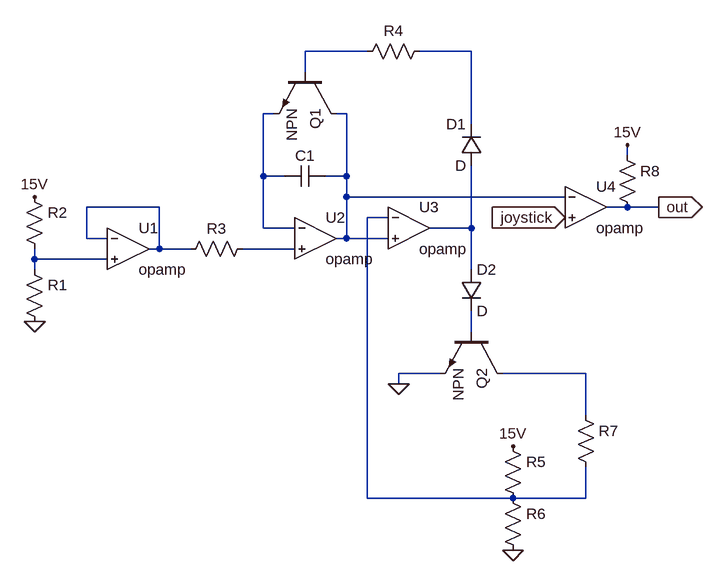
[diagram p0: schematic analogCircuit.asc]
analogCircuit.asc, the LTspice schematic file:
Version 4
SHEET 1 1264 692
WIRE 640 -144 544 -144
WIRE 800 -144 720 -144
WIRE 544 -112 544 -144
WIRE 496 -48 480 -48
WIRE 608 -48 592 -48
WIRE 800 -32 800 -144
WIRE 1040 16 1040 0
WIRE 480 48 480 -48
WIRE 512 48 480 48
WIRE 608 48 608 -48
WIRE 608 48 576 48
WIRE 608 80 608 48
WIRE 944 80 608 80
WIRE 320 96 208 96
WIRE 1040 96 1008 96
WIRE 1088 96 1040 96
WIRE 672 112 640 112
WIRE 480 128 480 48
WIRE 528 128 480 128
WIRE 800 128 800 32
WIRE 800 128 736 128
WIRE 208 144 208 96
WIRE 240 144 208 144
WIRE 608 144 608 80
WIRE 608 144 592 144
WIRE 672 144 608 144
WIRE 320 160 320 96
WIRE 320 160 304 160
WIRE 368 160 320 160
WIRE 528 160 448 160
WIRE 128 176 128 160
WIRE 240 176 128 176
WIRE 128 192 128 176
WIRE 800 192 800 128
WIRE 800 288 800 256
WIRE 752 352 688 352
WIRE 976 352 848 352
WIRE 688 368 688 352
WIRE 976 416 976 352
WIRE 640 544 640 112
WIRE 864 544 640 544
WIRE 976 544 976 496
WIRE 976 544 864 544
FLAG 128 272 0
FLAG 128 80 15V
FLAG 688 368 0
FLAG 864 624 0
FLAG 864 464 15V
FLAG 944 112 joystick
IOPIN 944 112 In
FLAG 1040 0 15V
FLAG 1088 96 out
IOPIN 1088 96 Out
SYMBOL res 112 176 R0
SYMATTR InstName R1
SYMATTR Value ""
SYMBOL Opamps\\opamp 560 80 R0
SYMATTR InstName U2
SYMBOL npn 592 -112 R90
SYMATTR InstName Q1
SYMBOL res 112 64 R0
SYMATTR InstName R2
SYMATTR Value ""
SYMBOL cap 576 32 R90
WINDOW 0 0 32 VBottom 2
WINDOW 3 32 32 VTop 2
SYMATTR InstName C1
SYMATTR Value ""
SYMBOL Opamps\\opamp 272 96 R0
SYMATTR InstName U1
SYMBOL res 464 144 R90
WINDOW 0 0 56 VBottom 2
WINDOW 3 32 56 VTop 2
SYMATTR InstName R3
SYMATTR Value ""
SYMBOL Opamps\\opamp 704 64 R0
SYMATTR InstName U3
SYMBOL diode 816 32 R180
WINDOW 0 24 64 Left 2
WINDOW 3 24 0 Left 2
SYMATTR InstName D1
SYMBOL res 736 -160 R90
WINDOW 0 0 56 VBottom 2
WINDOW 3 32 56 VTop 2
SYMATTR InstName R4
SYMATTR Value ""
SYMBOL diode 784 192 R0
SYMATTR InstName D2
SYMBOL npn 848 288 R90
SYMATTR InstName Q2
SYMBOL res 848 448 R0
SYMATTR InstName R5
SYMATTR Value ""
SYMBOL res 848 528 R0
SYMATTR InstName R6
SYMATTR Value ""
SYMBOL res 960 400 R0
SYMATTR InstName R7
SYMATTR Value ""
SYMBOL Opamps\\opamp 976 32 R0
SYMATTR InstName U4
SYMBOL res 1024 0 R0
SYMATTR InstName R8
SYMATTR Value ""

The netlist it stands for:
* analogCircuit.asc
R1 N009 0
XU2 N003 N008 N004 opamp Aol=100K GBW=10Meg  ; pins invin noninvin out
Q1 N004 N001 N003 0 NPN
R2 15V N009
C1 N004 N003
XU1 N005 N009 N005 opamp Aol=100K GBW=10Meg  ; pins invin noninvin out
R3 N008 N005
XU3 N006 N004 N007 opamp Aol=100K GBW=10Meg  ; pins invin noninvin out
D1 N007 N002 D
R4 N002 N001
D2 N007 N010 D
Q2 N011 N010 0 0 NPN
R5 15V N006
R6 N006 0
R7 N011 N006
XU4 N004 joystick out opamp Aol=100K GBW=10Meg  ; pins invin noninvin out
R8 15V out
.model D D
.lib standard.dio
.model NPN NPN
.model PNP PNP
.lib standard.bjt
.backanno
.end